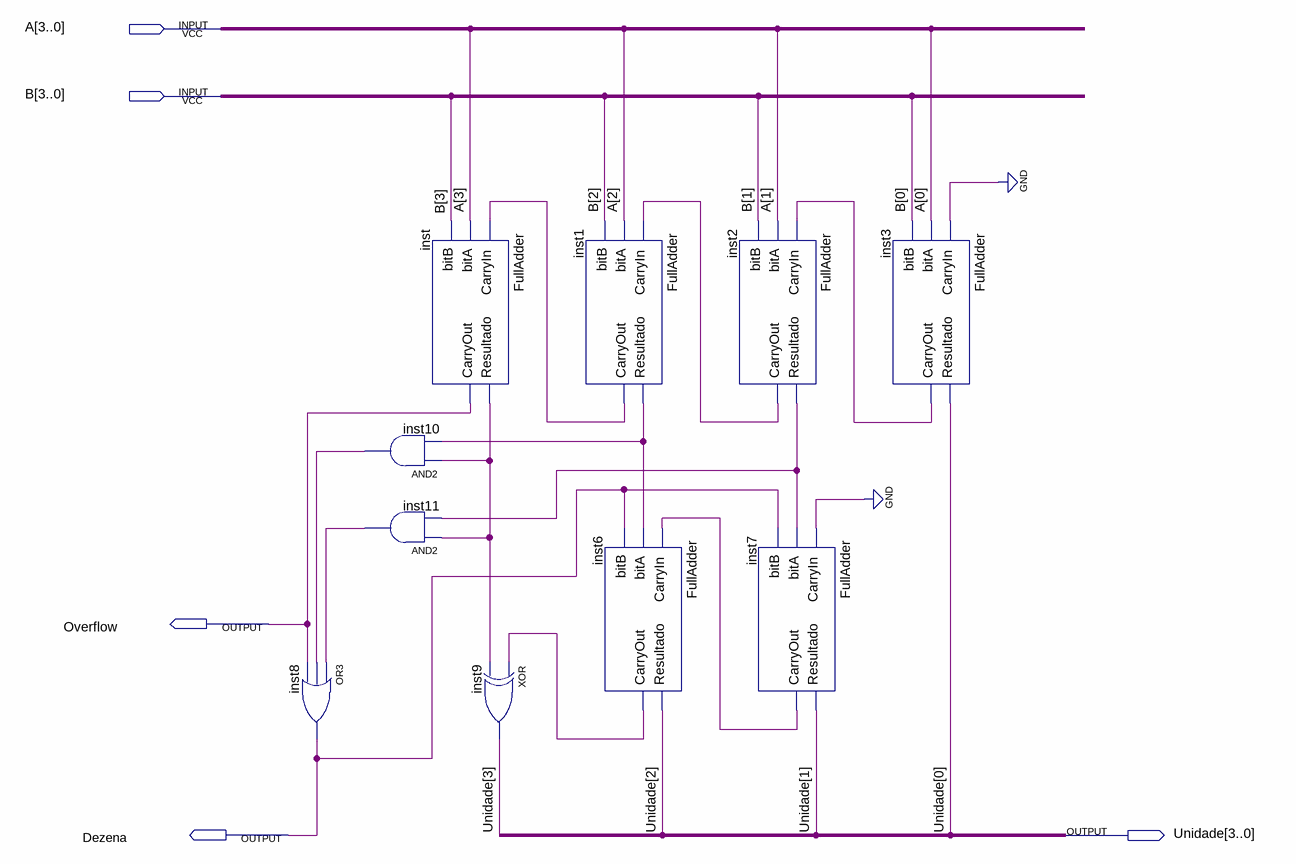
[diagram p0: schematic sheet]
// Quartus schematic SomadorBCD.bdf as structural Verilog: 10 symbols, 5 pins
module SomadorBCD (
  input  [3:0] A,
  input  [3:0] B,
  output Overflow,
  output Dezena,
  output [3:0] Unidade
);

  wire inst1_carryout, inst1_resultado, inst2_carryout, inst2_resultado, inst3_carryout, inst6_carryout,
       inst7_carryout, inst10_out, inst11_out, inst_resultado;

  or inst8 (Dezena, inst11_out, inst10_out, Overflow);
  and inst10 (inst10_out, inst_resultado, inst1_resultado);
  and inst11 (inst11_out, inst_resultado, inst2_resultado);
  FullAdder inst (.CarryIn(inst1_carryout), .bitA(A[3]), .bitB(B[3]), .Resultado(inst_resultado), .CarryOut(Overflow));
  xor inst9 (Unidade[3], inst6_carryout, inst_resultado);
  FullAdder inst1 (
    .CarryIn(inst2_carryout), .bitA(A[2]), .bitB(B[2]), .Resultado(inst1_resultado), .CarryOut(inst1_carryout));
  FullAdder inst6 (
    .CarryIn(inst7_carryout), .bitA(inst1_resultado), .bitB(Dezena), .Resultado(Unidade[2]),
    .CarryOut(inst6_carryout));
  FullAdder inst2 (
    .CarryIn(inst3_carryout), .bitA(A[1]), .bitB(B[1]), .Resultado(inst2_resultado), .CarryOut(inst2_carryout));
  FullAdder inst7 (
    .CarryIn(1'b0), .bitA(inst2_resultado), .bitB(Dezena), .Resultado(Unidade[1]), .CarryOut(inst7_carryout));
  FullAdder inst3 (.CarryIn(1'b0), .bitA(A[0]), .bitB(B[0]), .Resultado(Unidade[0]), .CarryOut(inst3_carryout));
endmodule
